# EAGLE design PAPx2-42 (EAGLE 7.2.0)
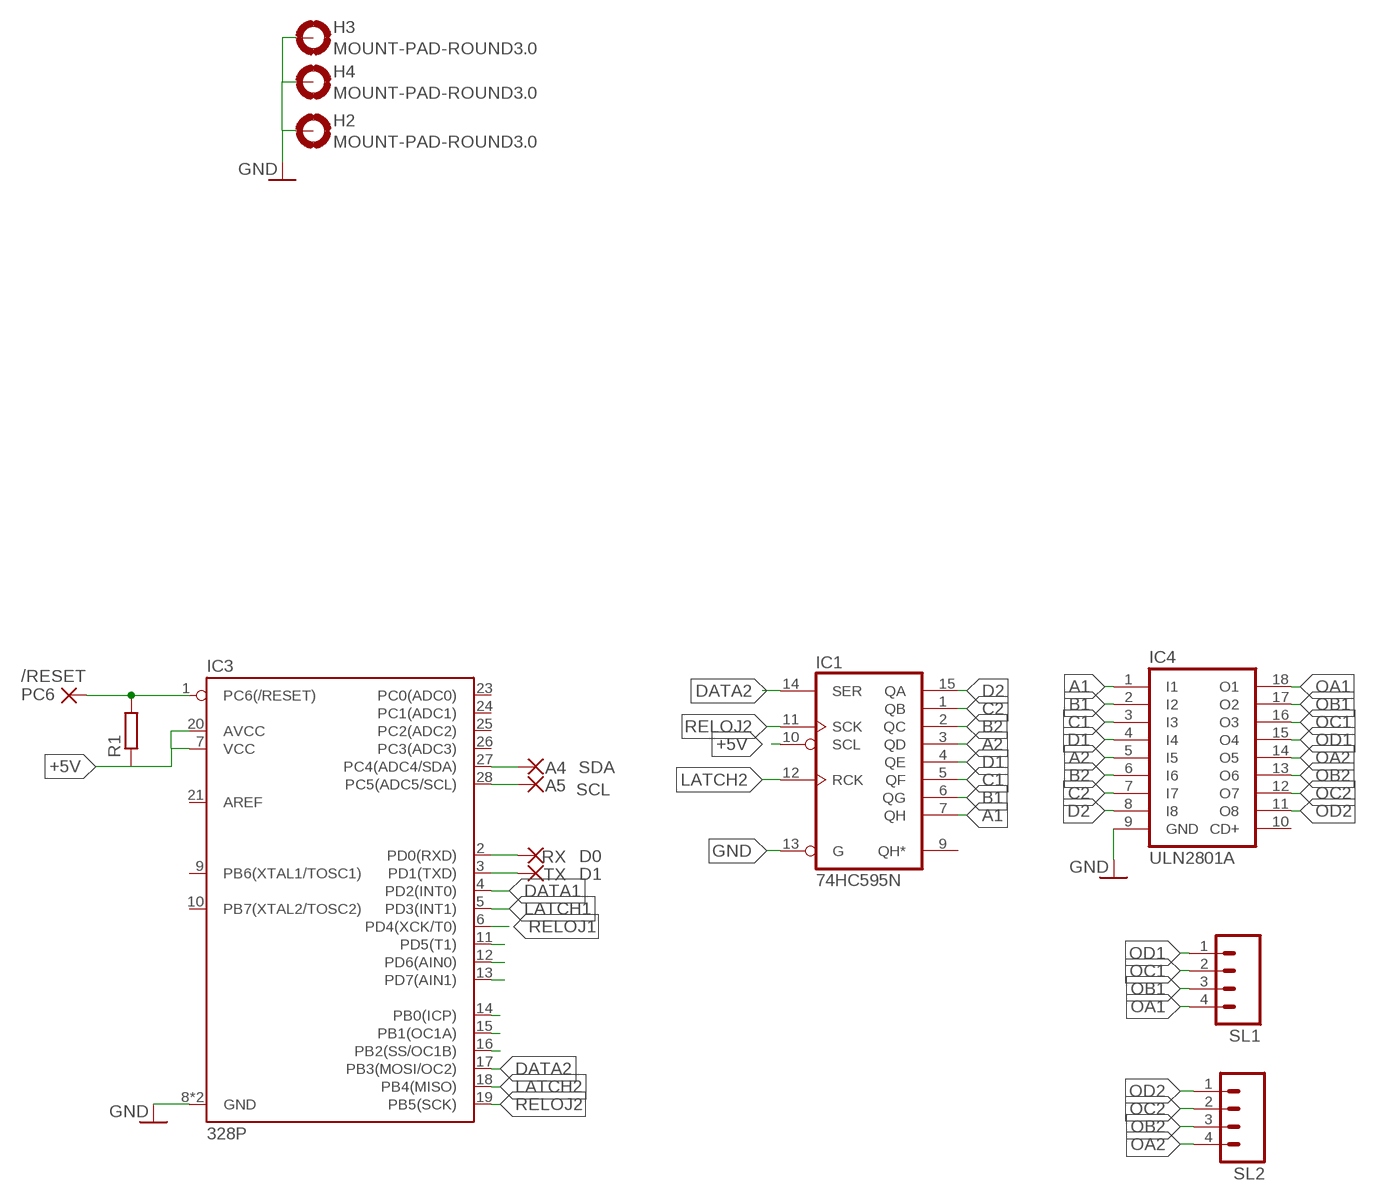
[diagram p0: schematic, sheet 1]

## Parts
/RESET  PC6  WIREPAD1,6/0,8  [1,6/0,8]
A4  SDA  WIREPAD1,6/0,8  [1,6/0,8]
A5  SCL  WIREPAD1,6/0,8  [1,6/0,8]
H2  MOUNT-PAD-ROUND3.0  [3,0-PAD]
H3  MOUNT-PAD-ROUND3.0  [3,0-PAD]
H4  MOUNT-PAD-ROUND3.0  [3,0-PAD]
IC1  74HC595N  [DIL16]
IC3  328P  ATMEGA328P  [DIP28]
IC4  ULN2801A  [DIL18]
R1  R-EU_0204/7  [0204/7]
RX  D0  WIREPAD1,6/0,8  [1,6/0,8]
SL1  M04  [04P]
SL2  M04  [04P]
TX  D1  WIREPAD1,6/0,8  [1,6/0,8]

## Nets
+5V: IC1.10(SCL) IC3.7(VCC) IC3.20(AVCC) R1.1
A1: IC1.7(QH) IC4.1(I1)
A2: IC1.3(QD) IC4.5(I5)
B1: IC1.6(QG) IC4.2(I2)
B2: IC1.2(QC) IC4.6(I6)
C1: IC1.5(QF) IC4.3(I3)
C2: IC1.1(QB) IC4.7(I7)
D1: IC1.4(QE) IC4.4(I4)
D2: IC1.15(QA) IC4.8(I8)
DATA1: IC3.4(PD2(INT0))
DATA2: IC1.14(SER) IC3.17(PB3(MOSI/OC2))
GND: H2.B3,0(MOUNT) H3.B3,0(MOUNT) H4.B3,0(MOUNT) IC1.13(G) IC3.8(GND) IC3.22(GND) IC4.9(GND)
LATCH1: IC3.5(PD3(INT1))
LATCH2: IC1.12(RCK) IC3.18(PB4(MISO))
N$1: IC3.2(PD0(RXD)) RX.1(P)
N$2: IC3.3(PD1(TXD)) TX.1(P)
N$3: /RESET.1(P) IC3.1(PC6(/RESET)) R1.2
N$5: A4.1(P) IC3.27(PC4(ADC4/SDA))
N$6: A5.1(P) IC3.28(PC5(ADC5/SCL))
N$11: IC3.16(PB2(SS/OC1B))
N$12: IC3.15(PB1(OC1A))
N$13: IC3.14(PB0(ICP))
N$14: IC3.13(PD7(AIN1))
N$15: IC3.12(PD6(AIN0))
N$16: IC3.11(PD5(T1))
OA1: IC4.18(O1) SL1.4
OA2: IC4.14(O5) SL2.4
OB1: IC4.17(O2) SL1.3
OB2: IC4.13(O6) SL2.3
OC1: IC4.16(O3) SL1.2
OC2: IC4.12(O7) SL2.2
OD1: IC4.15(O4) SL1.1
OD2: IC4.11(O8) SL2.1
RELOJ1: IC3.6(PD4(XCK/T0))
RELOJ2: IC1.11(SCK) IC3.19(PB5(SCK))
Unconnected: IC1.9(QH*) IC3.9(PB6(XTAL1/TOSC1)) IC3.10(PB7(XTAL2/TOSC2)) IC3.21(AREF) IC3.23(PC0(ADC0)) IC3.24(PC1(ADC1)) IC3.25(PC2(ADC2)) IC3.26(PC3(ADC3)) IC4.10(CD+)

## Power pins joined to a net without a drawn wire
GND: IC1.8(GND)
VCC: IC1.16(VCC)

## Library data of the parts
/RESET A4 A5 RX TX = wirepad:WIREPAD: Wire PAD connect wire on PCB
H2-H4 = holes:MOUNT-PAD-ROUND: MOUNTING PAD, round
IC1 = 74xx-eu:74*595: 8-bit SHIFT REGISTER, output latch
IC3 = treser_lib:ATMEGA328P: Atmel ATMEGA328P 32kb flash, 1k EEPROM, 2k SRAM; PROD_ID: IC-09136
IC4 = uln-udn:ULN2801A: DRIVER ARRAY
R1 = resistor:R-EU_: RESISTOR, European symbol
SL1 SL2 = con-amp-quick:M04: AMP QUICK CONNECTOR; OC_FARNELL: unknown; OC_NEWARK: unknown

## Board
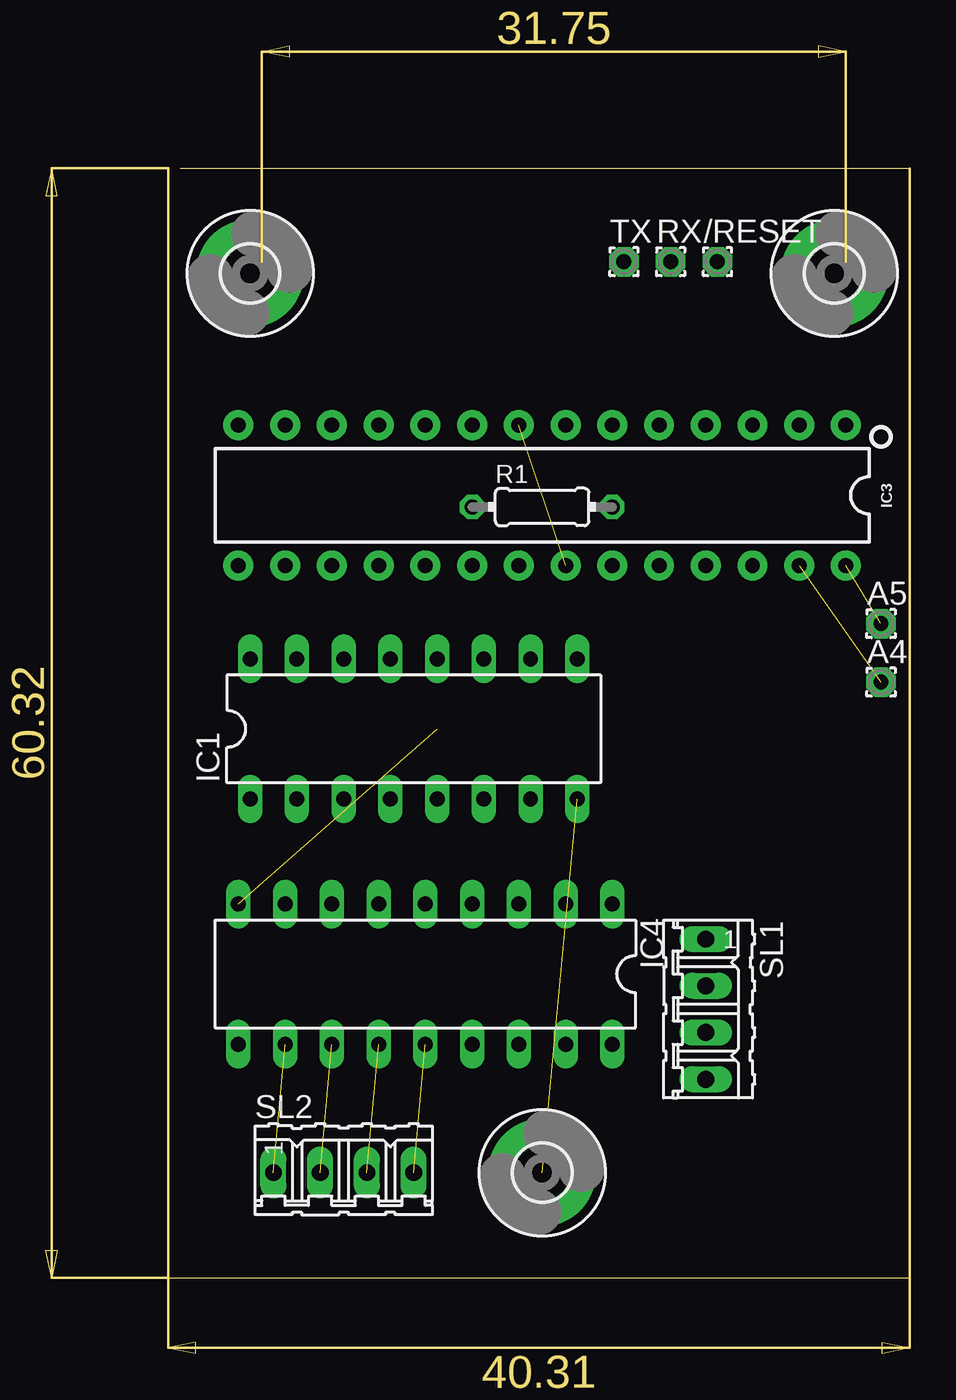
[diagram p1: board, top side]
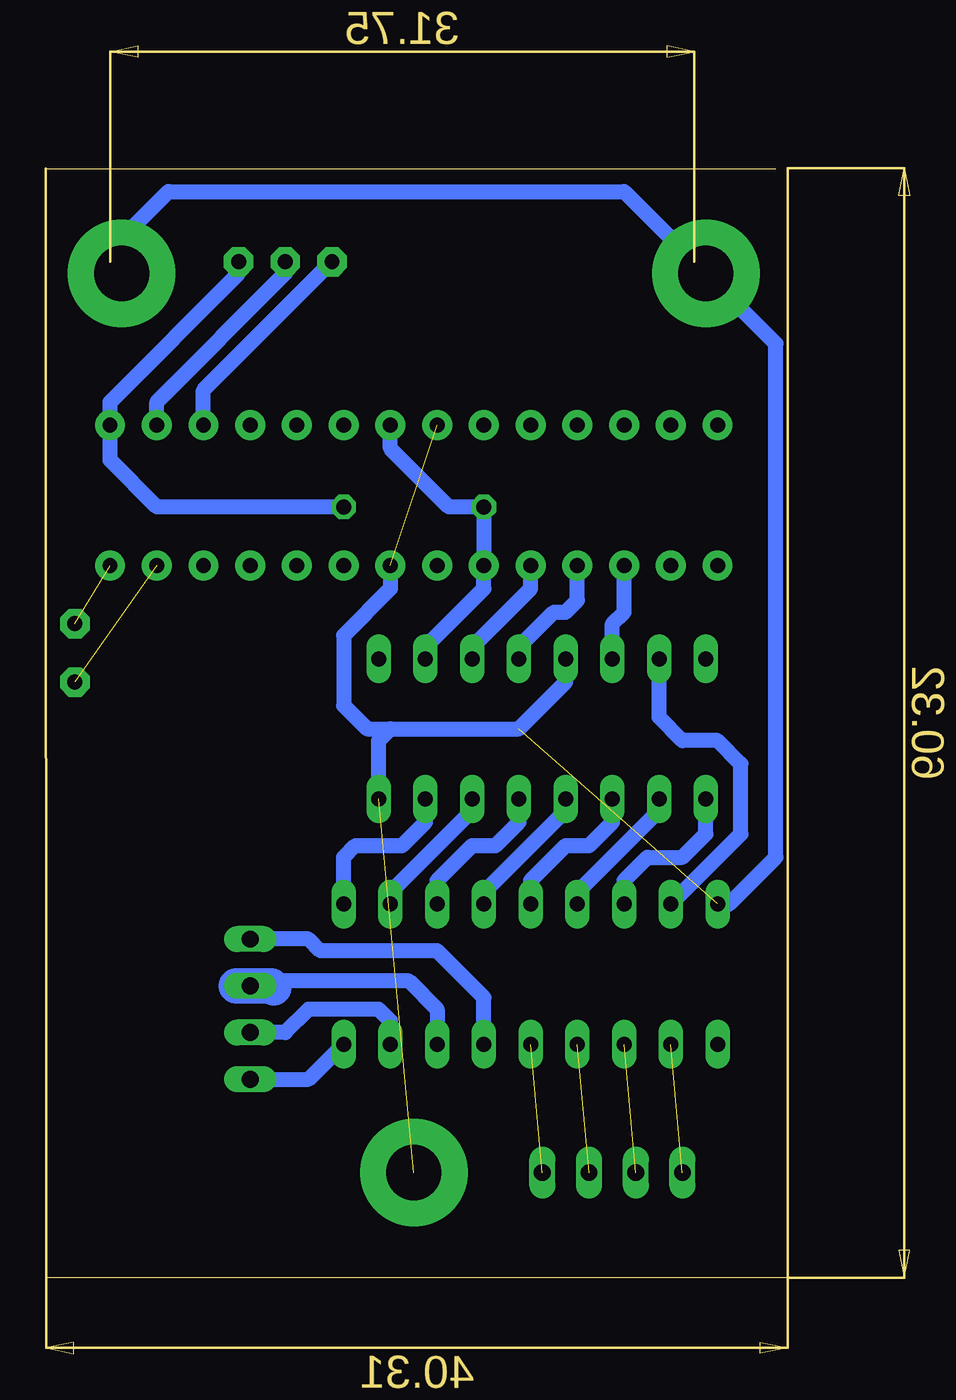
[diagram p2: board, bottom side, seen from below]

Size 40.31 x 60.31 mm. Coordinates in mm from the lower left corner, seen from the top.
Outline: 0,0 40.31,0 40.31,60.31 0.63,60.31
Copper layers (1*16): Top 0.035mm / dielectric 1.5mm / Bottom 0.035mm
Design rules "default": minimum track width 10mil, minimum drill 24mil, track to track 8mil, track to pad 8mil, pad to pad 8mil, via to via 8mil, smd to smd 8mil, copper to edge 40mil, drill to drill 8mil, minimum pad ring 10mil, minimum via ring 8mil, stop-mask expansion 4mil, vias tented up to drill 0mil, thermal gap 10mil

### Footprints (pad centres in the part's own frame; a part is rotated, then mirrored left to right if it is on the bottom)
1,6/0,8 = drill 0.813 pad 1.6 octagon: 1 0,0
3,0-PAD = drill 3 pad 5.842: B3,0 0,0
DIL16 = drill 0.813 long: 1 -8.89,-3.81; 2 -6.35,-3.81; 3 -3.81,-3.81; 4 -1.27,-3.81; 5 1.27,-3.81; 6 3.81,-3.81; 7 6.35,-3.81; 8 8.89,-3.81; 9 8.89,3.81; 10 6.35,3.81; 11 3.81,3.81; 12 1.27,3.81; 13 -1.27,3.81; 14 -3.81,3.81; 15 -6.35,3.81; 16 -8.89,3.81
DIP28 = drill 0.813 pad 1.626: 1 -16.51,-3.81; 2 -13.97,-3.81; 3 -11.43,-3.81; 4 -8.89,-3.81; 5 -6.35,-3.81; 6 -3.81,-3.81; 7 -1.27,-3.81; 8 1.27,-3.81; 9 3.81,-3.81; 10 6.35,-3.81; 11 8.89,-3.81; 12 11.43,-3.81; 13 13.97,-3.81; 14 16.51,-3.81; 15 16.51,3.81; 16 13.97,3.81; 17 11.43,3.81; 18 8.89,3.81; 19 6.35,3.81; 20 3.81,3.81; 21 1.27,3.81; 22 -1.27,3.81; 23 -3.81,3.81; 24 -6.35,3.81; 25 -8.89,3.81; 26 -11.43,3.81; 27 -13.97,3.81; 28 -16.51,3.81
DIL18 = drill 0.813 long: 1 -10.16,-3.81; 2 -7.62,-3.81; 3 -5.08,-3.81; 4 -2.54,-3.81; 5 0,-3.81; 6 2.54,-3.81; 7 5.08,-3.81; 8 7.62,-3.81; 9 10.16,-3.81; 10 10.16,3.81; 11 7.62,3.81; 12 5.08,3.81; 13 2.54,3.81; 14 0,3.81; 15 -2.54,3.81; 16 -5.08,3.81; 17 -7.62,3.81; 18 -10.16,3.81
0204/7 = drill 0.813 octagon: 1 -3.81,0; 2 3.81,0
04P = drill 0.914 long: 1 -3.81,0; 2 -1.27,0; 3 1.27,0; 4 3.81,0

### Placement (x,y rotation side)
/RESET  29.84,55.24 0 top
A4  38.73,32.38 0 top
A5  38.73,35.56 0 top
H2  4.44,54.61 0 top
H3  36.2,54.61 0 top
H4  20.32,5.71 0 top
IC1  13.34,29.84 0 top
IC3  20.32,42.54 180 top
IC4  13.97,16.51 180 top
R1  20.32,41.91 0 top
RX  27.3,55.24 0 top
SL1  29.21,14.6 270 top
SL2  9.53,5.71 0 top
TX  24.77,55.24 0 top

### Tracks (layer width: path | path; a pad name or v marks a point on that pad's centre or on a via)
+5V
  Bottom 0.813: IC1.10 19.69,34.29 16.51,37.46 IC3.20 R1.1 18.41,41.91 21.59,45.09 IC3.7
A1
  Bottom 0.813: IC4.1 24.13,22.86 23.5,23.49 20.96,23.49 19.69,24.77 IC1.7
A2
  Bottom 0.813: IC4.5 13.97,21.59 12.07,23.49 10.8,23.49 9.53,24.77 IC1.3
B1
  Bottom 0.813: IC4.2 21.59,20.95 17.14,25.4 IC1.6
B2
  Bottom 0.813: IC4.6 11.43,20.95 6.99,25.4 IC1.2
C1
  Bottom 0.813: IC4.3 19.05,21.59 17.14,23.49 15.88,23.49 14.61,24.77 IC1.5
C2
  Bottom 0.813: IC4.7 8.89,21.59 7.62,22.86 5.71,22.86 4.44,24.13 IC1.1
D1
  Bottom 0.813: IC4.4 16.51,20.95 12.07,25.4 IC1.4
D2
  Bottom 0.813: IC4.8 2.54,24.13 2.54,27.94 3.81,29.21 5.71,29.21 6.99,30.48 IC1.15
DATA2
  Bottom 0.813: IC1.14 9.53,35.56 8.89,36.2 IC3.17
GND  (3 unrouted)
  Bottom 0.813: IC1.8 22.23,29.21 21.59,29.84 | 21.59,29.84 14.61,29.84 12.07,32.38 IC1.13 | IC3.22 21.59,37.46 24.13,34.92 24.13,31.11 22.86,29.84 21.59,29.84 | IC4.9 3.17,20.32 0.63,22.86 0.63,50.8 H2.B3,0 8.89,59.05 33.66,59.05 36.2,56.51 H3.B3,0
LATCH2
  Bottom 0.813: IC1.12 14.61,34.29 12.7,36.2 12.07,36.2 11.43,36.83 IC3.18
N$1
  Bottom 0.813: IC3.2 34.29,47.62 27.3,54.61 RX.1
N$2
  Bottom 0.813: IC3.3 31.75,48.26 TX.1
N$3
  Bottom 0.813: /RESET.1 29.84,54.61 36.83,47.62 IC3.1 36.83,44.45 34.29,41.91 R1.2
N$5  (1 unrouted)
N$6  (1 unrouted)
OA1
  Bottom 0.813: SL1.4 26.04,10.79 IC4.18
OA2  (1 unrouted)
OB1
  Bottom 0.813: IC4.17 21.59,13.97 22.23,14.6 26.04,14.6 27.3,13.33 SL1.3
OB2  (1 unrouted)
OC1
  Bottom 0.813: IC4.16 19.05,14.6 20.57,16.13 27.43,16.13 27.81,15.75 27.94,15.75
  Bottom 1.93: 27.94,15.75 28.07,15.87 SL1.2 29.97,15.87
OC2  (1 unrouted)
OD1
  Bottom 0.813: IC4.15 16.51,15.24 19.05,17.78 25.4,17.78 26.04,18.41 SL1.1
OD2  (1 unrouted)
RELOJ2
  Bottom 0.813: IC1.11 17.14,34.29 13.97,37.46 IC3.19